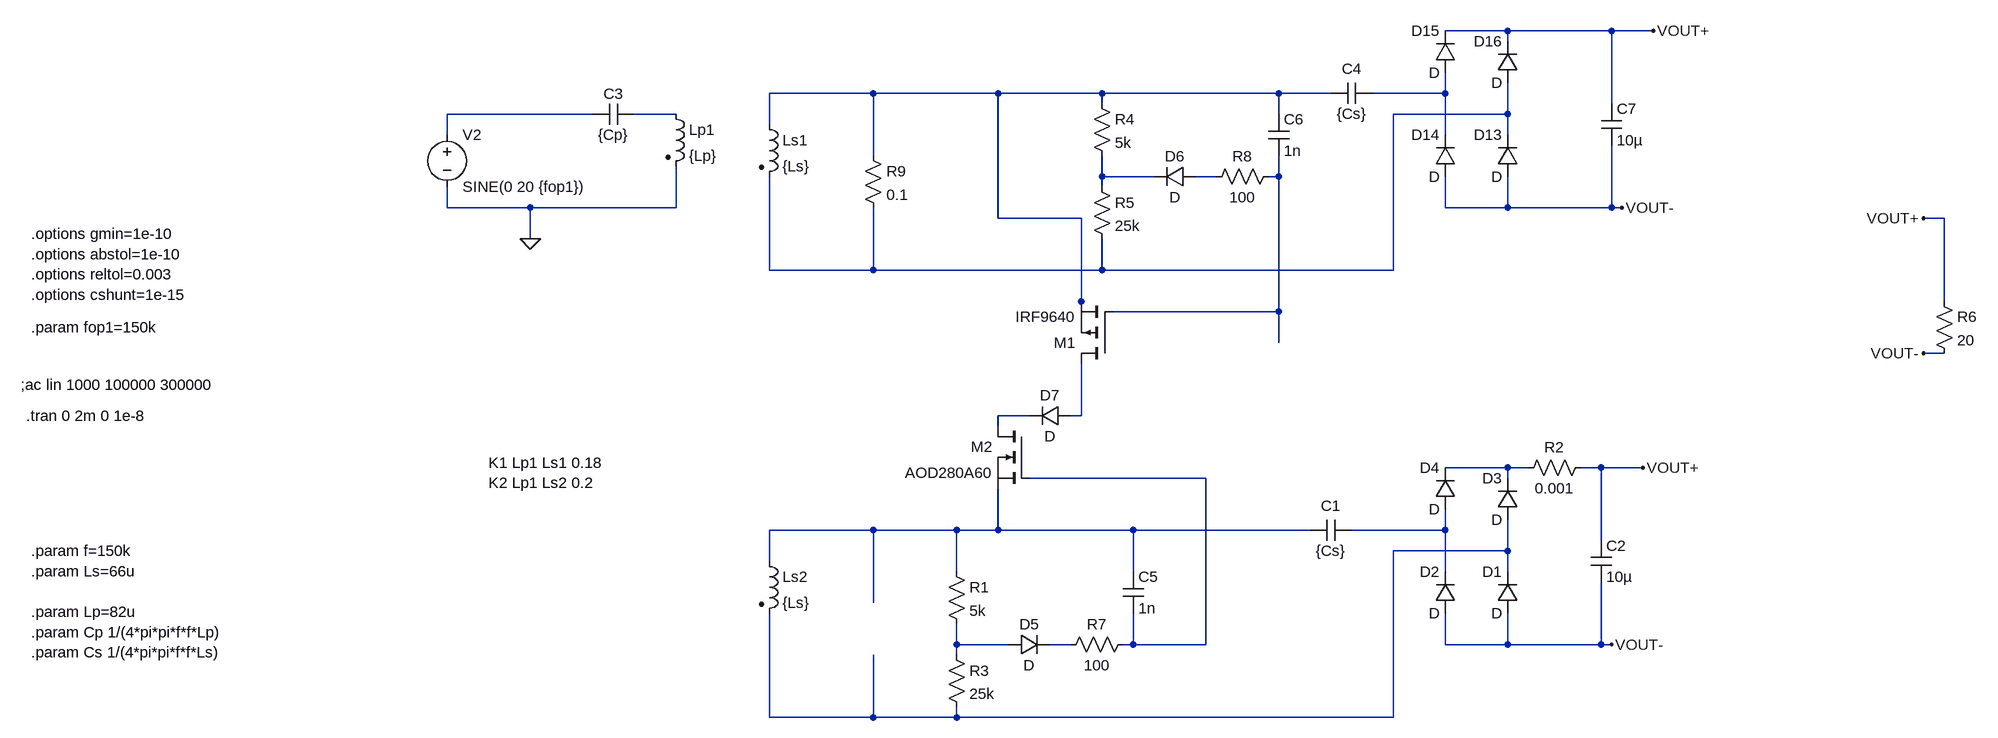
[diagram p0: schematic WPT_PMOS_NMOS.asc]
WPT_PMOS_NMOS.asc, the LTspice schematic file:
Version 4
SHEET 1 3864 3572
WIRE 2480 512 2384 512
WIRE 2640 512 2480 512
WIRE 2704 512 2640 512
WIRE 2480 528 2480 512
WIRE 1504 608 1344 608
WIRE 1696 608 1504 608
WIRE 1856 608 1696 608
WIRE 2128 608 1856 608
WIRE 2208 608 2128 608
WIRE 2384 608 2384 576
WIRE 2384 608 2272 608
WIRE 1856 624 1856 608
WIRE 2640 624 2640 512
WIRE 1072 640 848 640
WIRE 1200 640 1136 640
WIRE 2128 640 2128 608
WIRE 2480 640 2480 592
WIRE 2480 640 2304 640
WIRE 1344 656 1344 608
WIRE 848 672 848 640
WIRE 2384 672 2384 608
WIRE 2480 672 2480 640
WIRE 1504 704 1504 608
WIRE 1856 736 1856 704
WIRE 1936 736 1856 736
WIRE 2032 736 2000 736
WIRE 2128 736 2128 704
WIRE 2128 736 2112 736
WIRE 1856 752 1856 736
WIRE 848 784 848 752
WIRE 976 784 848 784
WIRE 1200 784 1200 720
WIRE 1200 784 976 784
WIRE 2384 784 2384 736
WIRE 2480 784 2480 736
WIRE 2480 784 2384 784
WIRE 2640 784 2640 688
WIRE 2640 784 2480 784
WIRE 2656 784 2640 784
WIRE 1696 800 1696 608
WIRE 1824 800 1696 800
WIRE 3152 800 3120 800
WIRE 976 832 976 784
WIRE 1344 880 1344 736
WIRE 1504 880 1504 784
WIRE 1504 880 1344 880
WIRE 1856 880 1856 832
WIRE 1856 880 1504 880
WIRE 2304 880 2304 640
WIRE 2304 880 1856 880
WIRE 1824 928 1824 800
WIRE 3152 928 3152 800
WIRE 2128 944 2128 736
WIRE 2128 944 1872 944
WIRE 1824 960 1824 928
WIRE 2128 992 2128 944
WIRE 3152 1008 3120 1008
WIRE 1744 1104 1696 1104
WIRE 1824 1104 1824 1024
WIRE 1824 1104 1808 1104
WIRE 1696 1120 1696 1104
WIRE 2480 1184 2384 1184
WIRE 2512 1184 2480 1184
WIRE 2624 1184 2592 1184
WIRE 2688 1184 2624 1184
WIRE 2016 1200 1744 1200
WIRE 2480 1200 2480 1184
WIRE 1504 1280 1344 1280
WIRE 1632 1280 1504 1280
WIRE 1696 1280 1696 1216
WIRE 1696 1280 1632 1280
WIRE 1904 1280 1696 1280
WIRE 2176 1280 1904 1280
WIRE 2384 1280 2384 1248
WIRE 2384 1280 2240 1280
WIRE 2624 1296 2624 1184
WIRE 2480 1312 2480 1264
WIRE 2480 1312 2304 1312
WIRE 1344 1328 1344 1280
WIRE 1632 1344 1632 1280
WIRE 1904 1344 1904 1280
WIRE 2384 1344 2384 1280
WIRE 2480 1344 2480 1312
WIRE 1504 1392 1504 1280
WIRE 1632 1456 1632 1424
WIRE 1712 1456 1632 1456
WIRE 1808 1456 1776 1456
WIRE 1904 1456 1904 1408
WIRE 1904 1456 1888 1456
WIRE 2016 1456 2016 1200
WIRE 2016 1456 1904 1456
WIRE 2384 1456 2384 1408
WIRE 2480 1456 2480 1408
WIRE 2480 1456 2384 1456
WIRE 2624 1456 2624 1360
WIRE 2624 1456 2480 1456
WIRE 2640 1456 2624 1456
WIRE 1632 1472 1632 1456
WIRE 1344 1568 1344 1408
WIRE 1504 1568 1504 1472
WIRE 1504 1568 1344 1568
WIRE 1632 1568 1632 1552
WIRE 1632 1568 1504 1568
WIRE 2304 1568 2304 1312
WIRE 2304 1568 1632 1568
FLAG 976 832 0
FLAG 2656 784 VOUT-
FLAG 3120 800 VOUT+
FLAG 3120 1008 VOUT-
FLAG 2688 1184 VOUT+
FLAG 2640 1456 VOUT-
FLAG 2704 512 VOUT+
SYMBOL ind2 1184 624 R0
SYMATTR InstName Lp1
SYMATTR Value {Lp}
SYMATTR Type ind
SYMBOL cap 1136 624 R90
WINDOW 0 0 32 VBottom 2
WINDOW 3 32 32 VTop 2
SYMATTR InstName C3
SYMATTR Value {Cp}
SYMBOL ind2 1328 640 R0
SYMATTR InstName Ls1
SYMATTR Value {Ls}
SYMATTR Type ind
SYMBOL cap 2272 592 R90
WINDOW 0 -6 32 VBottom 2
WINDOW 3 32 32 VTop 2
SYMATTR InstName C4
SYMATTR Value {Cs}
SYMBOL diode 2496 736 R180
WINDOW 0 24 64 Left 2
WINDOW 3 24 0 Left 2
SYMATTR InstName D13
SYMBOL diode 2400 736 R180
WINDOW 0 24 64 Left 2
WINDOW 3 24 0 Left 2
SYMATTR InstName D14
SYMBOL diode 2496 592 R180
WINDOW 0 24 64 Left 2
WINDOW 3 24 0 Left 2
SYMATTR InstName D16
SYMBOL diode 2400 576 R180
WINDOW 0 24 64 Left 2
WINDOW 3 24 0 Left 2
SYMATTR InstName D15
SYMBOL cap 2624 624 R0
SYMATTR InstName C7
SYMATTR Value 10µ
SYMBOL res 3136 912 R0
SYMATTR InstName R6
SYMATTR Value 20
SYMBOL ind2 1328 1312 R0
SYMATTR InstName Ls2
SYMATTR Value {Ls}
SYMATTR Type ind
SYMBOL cap 2240 1264 R90
WINDOW 0 -6 32 VBottom 2
WINDOW 3 32 32 VTop 2
SYMATTR InstName C1
SYMATTR Value {Cs}
SYMBOL diode 2496 1408 R180
WINDOW 0 24 64 Left 2
WINDOW 3 24 0 Left 2
SYMATTR InstName D1
SYMBOL diode 2400 1408 R180
WINDOW 0 24 64 Left 2
WINDOW 3 24 0 Left 2
SYMATTR InstName D2
SYMBOL diode 2496 1264 R180
WINDOW 0 24 64 Left 2
WINDOW 3 24 0 Left 2
SYMATTR InstName D3
SYMBOL diode 2400 1248 R180
WINDOW 0 24 64 Left 2
WINDOW 3 24 0 Left 2
SYMATTR InstName D4
SYMBOL cap 2608 1296 R0
SYMATTR InstName C2
SYMATTR Value 10µ
SYMBOL res 2608 1168 R90
WINDOW 0 0 56 VBottom 2
WINDOW 3 32 56 VTop 2
SYMATTR InstName R2
SYMATTR Value 0.001
SYMBOL voltage 848 656 R0
WINDOW 123 0 0 Left 0
WINDOW 39 0 0 Left 0
SYMATTR InstName V2
SYMATTR Value SINE(0 20 {fop1})
SYMBOL res 1616 1328 R0
SYMATTR InstName R1
SYMATTR Value 5k
SYMBOL res 1616 1456 R0
SYMATTR InstName R3
SYMATTR Value 25k
SYMBOL res 1840 608 R0
SYMATTR InstName R4
SYMATTR Value 5k
SYMBOL res 1840 736 R0
SYMATTR InstName R5
SYMATTR Value 25k
SYMBOL pmos 1872 1024 R180
SYMATTR InstName M1
SYMATTR Value IRF9640
SYMBOL nmos 1744 1120 M0
SYMATTR InstName M2
SYMATTR Value AOD280A60
SYMBOL diode 1808 1088 R90
WINDOW 0 0 32 VBottom 2
WINDOW 3 32 32 VTop 2
SYMATTR InstName D7
SYMBOL diode 1712 1472 R270
WINDOW 0 32 32 VTop 2
WINDOW 3 0 32 VBottom 2
SYMATTR InstName D5
SYMBOL res 1904 1440 R90
WINDOW 0 0 56 VBottom 2
WINDOW 3 32 56 VTop 2
SYMATTR InstName R7
SYMATTR Value 100
SYMBOL cap 1888 1344 R0
SYMATTR InstName C5
SYMATTR Value 1n
SYMBOL diode 2000 720 R90
WINDOW 0 0 32 VBottom 2
WINDOW 3 32 32 VTop 2
SYMATTR InstName D6
SYMBOL res 2128 720 R90
WINDOW 0 0 56 VBottom 2
WINDOW 3 32 56 VTop 2
SYMATTR InstName R8
SYMATTR Value 100
SYMBOL cap 2112 640 R0
SYMATTR InstName C6
SYMATTR Value 1n
SYMBOL res 1488 688 R0
SYMATTR InstName R9
SYMATTR Value 0.1
TEXT 200 1104 Left 2 !.tran 0 2m 0 1e-8
TEXT 208 1312 Left 2 !.param f=150k  \n.param Ls=66u\n \n.param Lp=82u\n.param Cp 1/(4*pi*pi*f*f*Lp)\n.param Cs 1/(4*pi*pi*f*f*Ls)
TEXT 192 1056 Left 2 !;ac lin 1000 100000 300000
TEXT 208 968 Left 2 !.param fop1=150k
TEXT 208 824 Left 2 !.options gmin=1e-10   \n.options abstol=1e-10  \n.options reltol=0.003  \n.options cshunt=1e-15
TEXT 912 1176 Left 2 !K1 Lp1 Ls1 0.18\nK2 Lp1 Ls2 0.2

The netlist it stands for:
* WPT_PMOS_NMOS.asc
Lp1 N004 0 {Lp}
C3 N004 N003 {Cp}
Ls1 N001 N005 {Ls}
C4 N002 N001 {Cs}
D13 VOUT- N005 D
D14 VOUT- N002 D
D16 N005 VOUT+ D
D15 N002 VOUT+ D
C7 VOUT+ VOUT- 10µ
R6 VOUT+ VOUT- 20
Ls2 N013 N015 {Ls}
C1 N014 N013 {Cs}
D1 VOUT- N015 D
D2 VOUT- N014 D
D3 N015 N011 D
D4 N014 N011 D
C2 VOUT+ VOUT- 10µ
R2 VOUT+ N011 0.001
V2 N003 0 SINE(0 20 {fop1})
R1 N013 N016 5k
R3 N016 N015 25k
R4 N001 N006 5k
R5 N006 N005 25k
M1 N010 N008 N001 N001 IRF9640
M2 N009 N012 N013 N013 AOD280A60
D7 N010 N009 D
D5 N016 N017 D
R7 N012 N017 100
C5 N013 N012 1n
D6 N007 N006 D
R8 N008 N007 100
C6 N001 N008 1n
R9 N001 N005 0.1
.model D D
.lib standard.dio
.model NMOS NMOS
.model PMOS PMOS
.lib standard.mos
.tran 0 2m 0 1e-8
.param f=150k
.param Ls=66u
.param Lp=82u
.param Cp 1/(4*pi*pi*f*f*Lp)
.param Cs 1/(4*pi*pi*f*f*Ls)
;ac lin 1000 100000 300000
.param fop1=150k
.options gmin=1e-10
.options abstol=1e-10
.options reltol=0.003
.options cshunt=1e-15
K1 Lp1 Ls1 0.18
K2 Lp1 Ls2 0.2
.backanno
.end